# Altium schematic sheet Connectors.SchDoc
size A; SheetNumber: 5; SheetTotal: 7
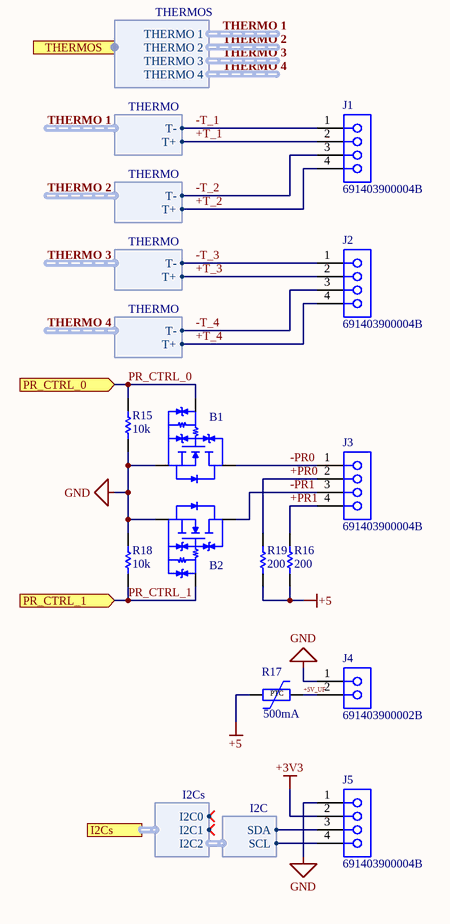
[diagram p0: Connectors.SchDoc]

## Parts
B1  CMP-532-000000-3  [SOTFL95P240X88-3N]  (value not drawn)
B2  CMP-532-000000-3  [SOTFL95P240X88-3N]  (value not drawn)
J1  691403900004B  [691403900004B]
J2  691403900004B  [691403900004B]
J3  691403900004B  [691403900004B]
J4  691403900002B  [691403900002B]
J5  691403900004B  [691403900004B]
R15  value 10k  [RES 0805_2012]  (hidden comment: CRCW080510K0FKEAC)
R16  value 200  [RES 1206_3216]  (hidden comment: ERA-8AEB201V)
R17  CMP-009-00302-6  [RESC3216X125N]  (value not drawn)
R18  value 10k  [RES 0805_2012]  (hidden comment: CRCW080510K0FKEAC)
R19  value 200  [RES 1206_3216]  (hidden comment: ERA-8AEB201V)

## Ports
I2Cs (harness I2Cs), PR_CTRL_0 (in), PR_CTRL_1 (in), THERMOS (out, harness THERMOS)

## Harnesses
THERMOS: THERMO 1, THERMO 2, THERMO 3, THERMO 4
THERMO: T+, T-
I2C: SDA, SCL
I2Cs: I2C1, I2C0, I2C2

## Nets
+3V3: J5.2
+5: R16.1 R17.1 R19.1
GND: B1.2(S) B2.2(S) J4.1 J5.1 R15.1 R18.2
+5V_UF: J4.2 R17.2
+PR0: J3.2 R19.2
+PR1: J3.4 R16.2
+T_1: J1.2 ; harness THERMO.T+
+T_2: J1.4 ; harness THERMO.T+
+T_3: J2.2 ; harness THERMO.T+
+T_4: J2.4 ; harness THERMO.T+
-PR0: B1.3(D) J3.1
-PR1: B2.3(D) J3.3
-T_1: J1.1 ; harness THERMO.T-
-T_2: J1.3 ; harness THERMO.T-
-T_3: J2.1 ; harness THERMO.T-
-T_4: J2.3 ; harness THERMO.T-
PR_CTRL_0: B1.1(G) R15.2 ; port PR_CTRL_0
PR_CTRL_1: B2.1(G) R18.1 ; port PR_CTRL_1
NetJ5_3: J5.3 ; harness I2C.SDA
NetJ5_4: J5.4 ; harness I2C.SCL

## Notes on the sheet
- (in symbol CMP-009-00016-3) PTC

## Library data of the parts
B1 B2 = CMP-752-000002-2: Trans MOSFET N-CH Si 60V 0.65A Automotive 3-Pin SOT-23F T/R; Source: SSM3K357R,LF.SchLib; Design Item ID: SSM3K357R,LF
J1-J3 J5 = CMP-752-000001-2: Barrier Strip Terminal Block; Manufacturer Series: 4039B; Terminal and Terminal Block Type: BARRIER STRIP TERMINAL BLOCK; RoHS Compliant: Yes; Reach SVHC Compliant: Yes; Design Item ID: CMP-002-00140-1; Source: HeatPress.SCHLIB
J4 = CMP-752-000000-2: Barrier Strip Terminal Block; Manufacturer Series: 4039B; Terminal and Terminal Block Type: BARRIER STRIP TERMINAL BLOCK; Reach SVHC Compliant: Yes; RoHS Compliant: Yes; Design Item ID: CMP-002-00139-1; Source: HeatPress.SCHLIB
R15 R18 = CMP-009-00022-1: Fixed Resistor, Metal Glaze/thick Film, 0.125W, 10000ohm, 150V, 1% +/-Tol, 100ppm/Cel, Surface Mount, 0805; Package Width: 1.25mm; Temperature Coefficient: -100100ppm/°C; Power: 125mW; Package Height: 0.5mm; Package Length: 2mm; Min Operating Temperature: -55°C; Resistor Type: FIXED RESISTOR; Package Style: SMTMeter; Tolerance: 1%; RoHS Compliant: Yes; Construction: Chip; Reach SVHC Compliant: Yes; Pins: 2; Packaging: Tape and Reel; Max Operating Temperature: 155°C; Technology: METAL GLAZE/THICK FILM; Case/Package: 0805; JESD-609 Code: e3; Working Voltage: 150V; Terminal Finish: Nickel
R16 R19 = CMP-009-00023-1: Res Thin Film 1206 200 Ohm 0.1% 1/4W ±25ppm/°C Molded SMD SMD Punched Carrier T/R; Package Height: 0.6mm; Rated Temperature: 85°C; Working Voltage: 150V; Reference Standard: AEC-Q200; Package Length: 3.2mm; Power: 250mW; Package Width: 1.6mm; Max Operating Temperature: 155°C; Mounting Technology: Surface Mount; Temperature Coefficient: 25ppm/°C; Min Operating Temperature: -55°C; Termination: Wraparound; Tolerance: 0.1%; RoHS Compliant: Yes; Reach SVHC Compliant: Yes; Resistor Type: FIXED RESISTOR; Technology: THIN FILM; Case/Package: 1206; Construction: Rectangular; Package Style: SMTMeter; Terminal Finish: Nickel; JESD-609 Code: e3; Pins: 2; Packaging: Tape and Reel
R17 = CMP-009-00016-3: PTC Resettable Fuse, 24V, 0.15ohm, Surface Mount; Package Length: 3.5mm; MP: 0ZCJ0050AF2E; MF: {'manufacturer': u'Bel Fuse'}; Current Rating: 500mA; Value: 0.75; Package Width: 1.8mm; Package Height: 1.2mm; Reference Standard: UL; Price: None; Reach SVHC Compliant: Yes; JESD-609 Code: e3; RoHS Compliant: Yes; Resistor Type: PTC THERMISTOR; Availability: Unavailable; Working Voltage: 24V; Max Operating Temperature: 85°C; Design Item ID: 0ZCJ0050AF2E; Source: 0ZCJ0050AF2E.SchLib; Terminal Finish: Tin; Case/Package: None; Min Operating Temperature: -40°C